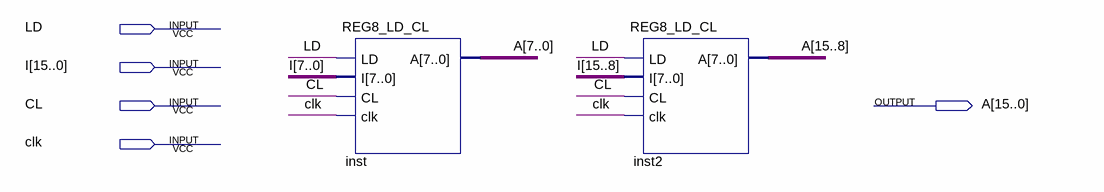
[diagram p0: schematic sheet]
// Quartus schematic REG16_LD_CL.bdf as structural Verilog: 2 symbols, 5 pins
module REG16_LD_CL (
  input  LD,
  input  [15:0] I,
  input  CL,
  input  clk,
  output [15:0] A
);

  REG8_LD_CL inst (.LD(LD), .I(I[7:0]), .CL(CL), .clk(clk), .A(A[7:0]));
  REG8_LD_CL inst2 (.LD(LD), .I(I[15:8]), .CL(CL), .clk(clk), .A(A[15:8]));
endmodule
